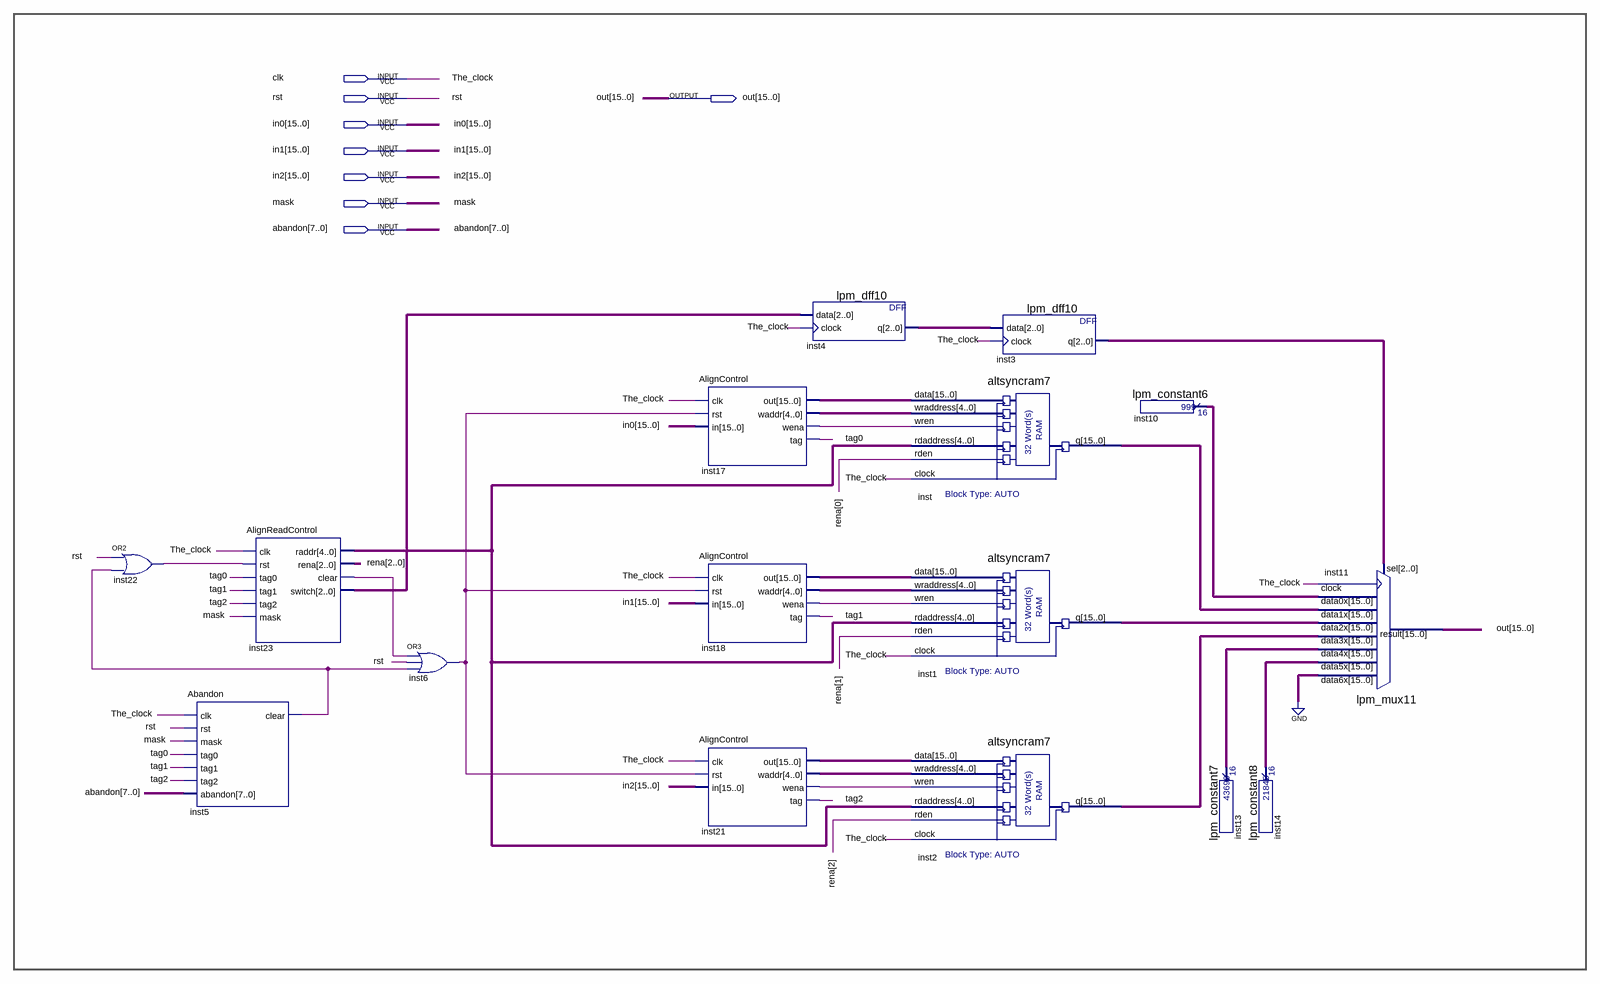
[diagram p0: schematic sheet]
// Quartus schematic Alignment2.bdf as structural Verilog: 16 symbols, 8 pins
module Alignment2 (
  input  clk,
  input  rst,
  input  [15:0] in0,
  input  [15:0] in1,
  input  [15:0] in2,
  input  mask,
  input  [7:0] abandon,
  output [15:0] out
);

  wire inst5_clear, inst6_out, inst17_wena, inst18_wena, inst21_wena, inst22_out, inst23_clear, tag0, tag1,
       tag2;
  wire [2:0] inst3_q, inst4_q, inst23_switch, rena;
  wire [4:0] inst17_waddr, inst18_waddr, inst21_waddr, inst23_raddr;
  wire [15:0] inst1_q, inst2_q, inst10_result, inst13_result, inst14_result, inst17_out, inst18_out,
       inst21_out, inst_q;

  or inst22 (inst22_out, rst, inst5_clear);
  Abandon inst5 (
    .clk(clk), .rst(rst), .mask(mask), .tag0(tag0), .tag1(tag1), .tag2(tag2), .abandon(abandon),
    .clear(inst5_clear));
  AlignReadControl inst23 (
    .clk(clk), .rst(inst22_out), .tag0(tag0), .tag1(tag1), .tag2(tag2), .mask(mask), .raddr(inst23_raddr),
    .rena(rena), .clear(inst23_clear), .switch(inst23_switch));
  or inst6 (inst6_out, inst23_clear, rst, inst5_clear);
  AlignControl inst17 (
    .clk(clk), .rst(inst6_out), .in(in0), .out(inst17_out), .waddr(inst17_waddr), .wena(inst17_wena),
    .tag(tag0));
  AlignControl inst18 (
    .clk(clk), .rst(inst6_out), .in(in1), .out(inst18_out), .waddr(inst18_waddr), .wena(inst18_wena),
    .tag(tag1));
  AlignControl inst21 (
    .clk(clk), .rst(inst6_out), .in(in2), .out(inst21_out), .waddr(inst21_waddr), .wena(inst21_wena),
    .tag(tag2));
  lpm_dff10 inst4 (.data(inst23_switch), .clock(clk), .q(inst4_q));
  altsyncram7 inst (
    .data(inst17_out), .wraddress(inst17_waddr), .wren(inst17_wena), .rdaddress(inst23_raddr),
    .rden(rena[0]), .clock(clk), .q(inst_q));
  altsyncram7 inst1 (
    .data(inst18_out), .wraddress(inst18_waddr), .wren(inst18_wena), .rdaddress(inst23_raddr),
    .rden(rena[1]), .clock(clk), .q(inst1_q));
  altsyncram7 inst2 (
    .data(inst21_out), .wraddress(inst21_waddr), .wren(inst21_wena), .rdaddress(inst23_raddr),
    .rden(rena[2]), .clock(clk), .q(inst2_q));
  lpm_dff10 inst3 (.data(inst4_q), .clock(clk), .q(inst3_q));
  lpm_constant6 inst10 (.result(inst10_result));
  lpm_constant7 inst13 (.result(inst13_result));
  lpm_constant8 inst14 (.result(inst14_result));
  lpm_mux11 inst11 (
    .data6x({16{1'b0}}), .data5x(inst14_result), .data4x(inst13_result), .data3x(inst2_q), .data2x(inst1_q),
    .data1x(inst_q), .data0x(inst10_result), .clock(clk), .sel(inst3_q), .result(out));

  // Other names for the same wires on the sheet: The_clock = clk
endmodule
